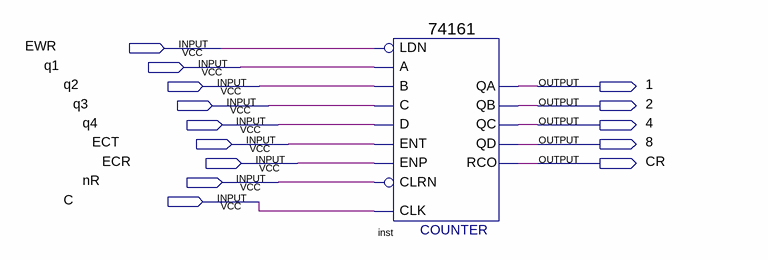
[diagram p0: schematic sheet]
// Quartus schematic kp15533IE10.bdf as structural Verilog: 1 symbols, 14 pins
module kp15533IE10 (
  input  EWR,
  input  q1,
  input  q2,
  input  q3,
  input  q4,
  input  ECT,
  input  ECR,
  input  nR,
  input  C,
  output \1 ,
  output \2 ,
  output \4 ,
  output \8 ,
  output CR
);

  \74161  inst (
    .CLRN(nR), .CLK(C), .ENP(ECR), .LDN(EWR), .A(q1), .D(q4), .ENT(ECT), .B(q2), .C(q3), .QD(\8 ), .QC(\4 ),
    .QB(\2 ), .QA(\1 ), .RCO(CR));
endmodule
